# EAGLE design QFN32-TQFP32 v1.0 (EAGLE 7.2.0)
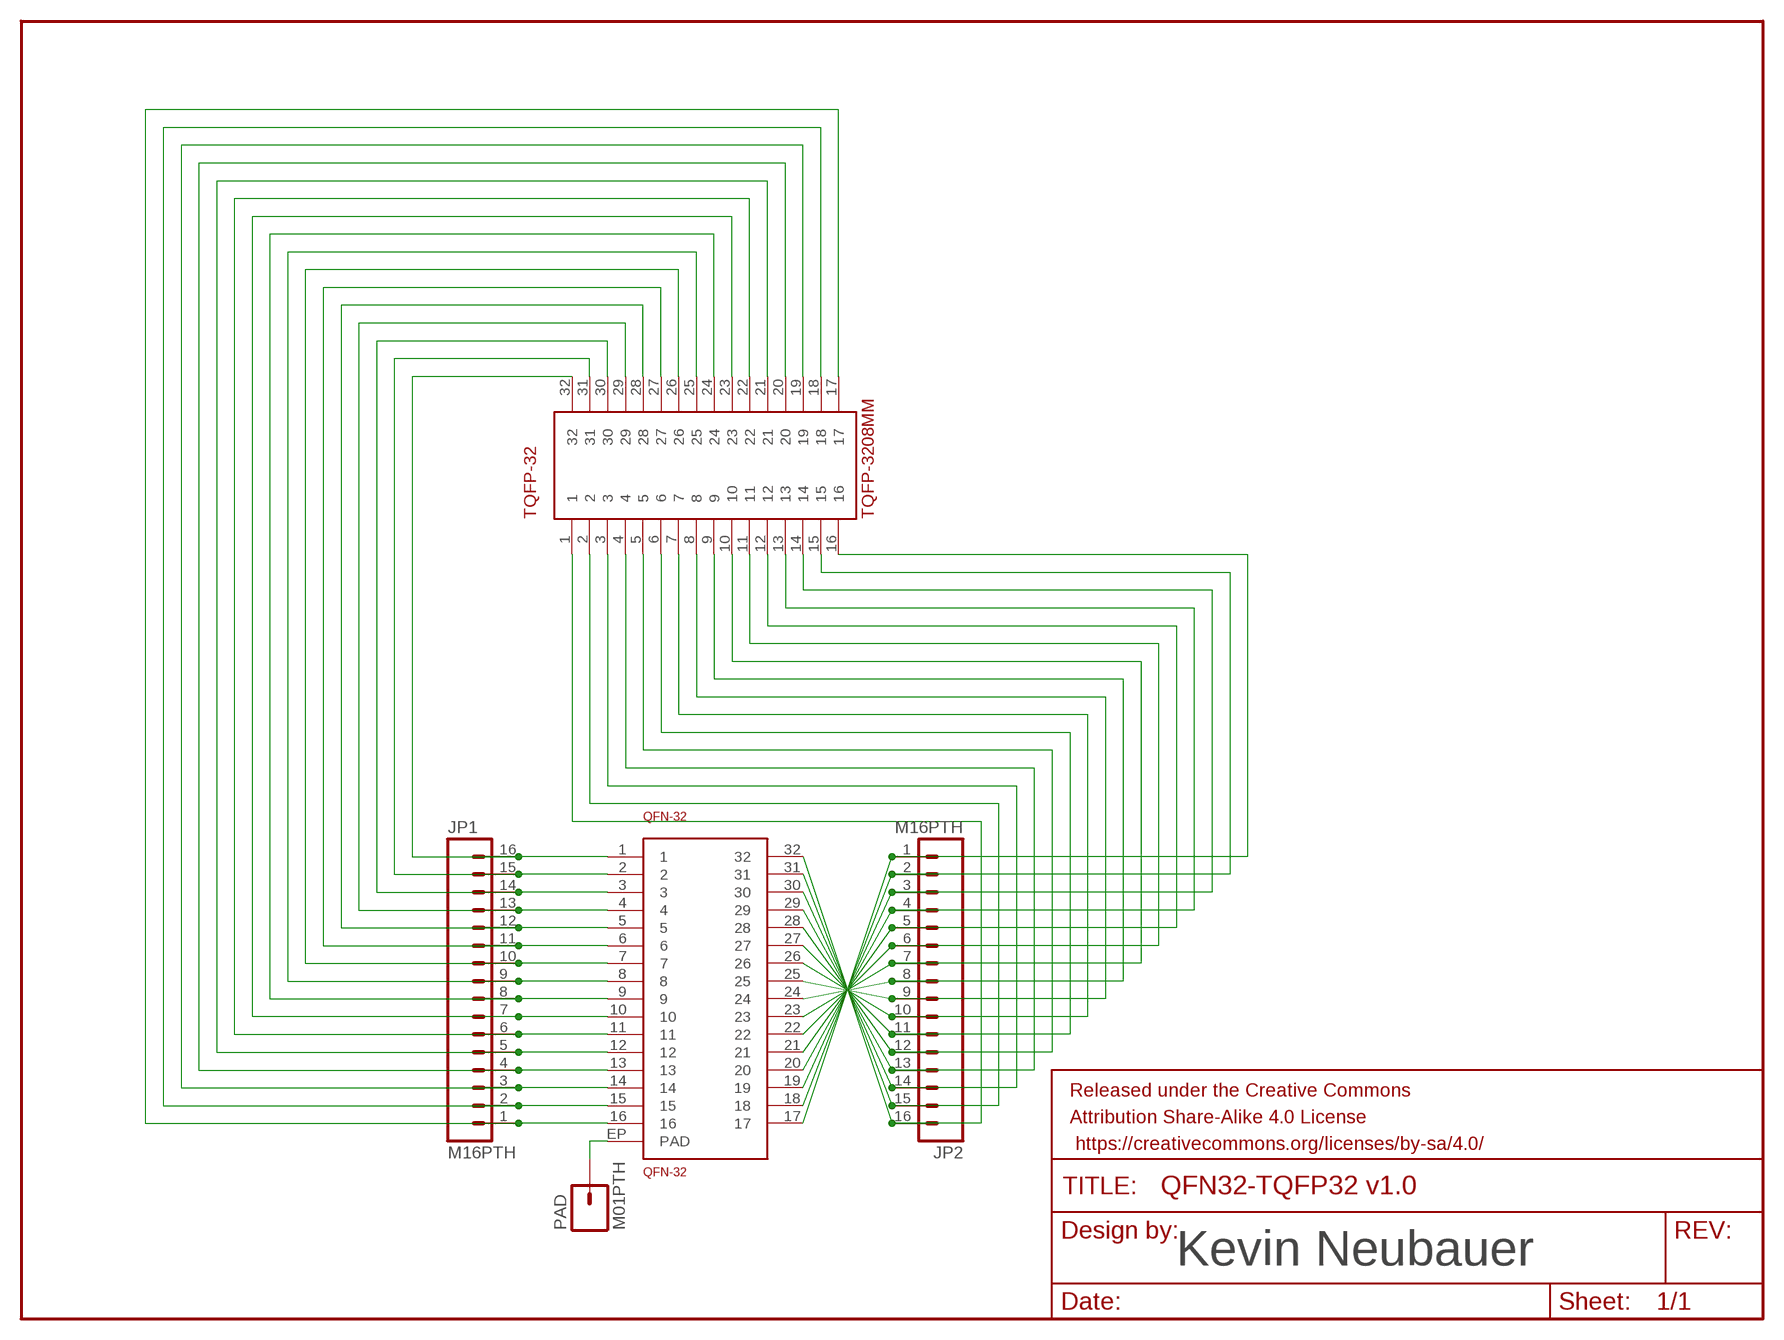
[diagram p0: schematic, sheet 1]

## Parts
FRAME1  FRAME-LETTER  [CREATIVE_COMMONS]
JP1  M16PTH  [1X16]
JP2  M16PTH  [1X16]
PAD  M01PTH  [1X01]
QFN-32  QFN-32  [QFN-32]
TQFP-32  TQFP-3208MM  [TQFP32-08]

## Nets
GND: PAD.1 QFN-32.EP(PAD)
N$1: JP2.9 QFN-32.25 TQFP-32.8
N$2: JP1.16 QFN-32.1 TQFP-32.32
N$3: JP1.15 QFN-32.2 TQFP-32.31
N$4: JP1.14 QFN-32.3 TQFP-32.30
N$5: JP1.13 QFN-32.4 TQFP-32.29
N$7: JP1.11 QFN-32.6 TQFP-32.27
N$8: JP1.10 QFN-32.7 TQFP-32.26
N$9: JP1.9 QFN-32.8 TQFP-32.25
N$10: JP1.8 QFN-32.9 TQFP-32.24
N$11: JP1.7 QFN-32.10 TQFP-32.23
N$12: JP1.6 QFN-32.11 TQFP-32.22
N$13: JP1.5 QFN-32.12 TQFP-32.21
N$14: JP1.4 QFN-32.13 TQFP-32.20
N$15: JP1.3 QFN-32.14 TQFP-32.19
N$16: JP1.2 QFN-32.15 TQFP-32.18
N$17: JP1.1 QFN-32.16 TQFP-32.17
N$20: JP2.14 QFN-32.30 TQFP-32.3
N$21: JP2.13 QFN-32.29 TQFP-32.4
N$22: JP2.12 QFN-32.28 TQFP-32.5
N$23: JP2.11 QFN-32.27 TQFP-32.6
N$24: JP2.10 QFN-32.26 TQFP-32.7
N$25: JP2.2 QFN-32.18 TQFP-32.15
N$26: JP2.8 QFN-32.24 TQFP-32.9
N$27: JP2.7 QFN-32.23 TQFP-32.10
N$29: JP2.5 QFN-32.21 TQFP-32.12
N$30: JP2.4 QFN-32.20 TQFP-32.13
N$31: JP2.3 QFN-32.19 TQFP-32.14
N$32: JP2.15 QFN-32.31 TQFP-32.2
N$33: JP2.16 QFN-32.32 TQFP-32.1
N$35: JP2.1 QFN-32.17 TQFP-32.16
N$36: JP1.12 QFN-32.5 TQFP-32.28
N$41: JP2.6 QFN-32.22 TQFP-32.11

## Notes on the sheet
- Kevin Neubauer

## Library data of the parts
FRAME1 = SparkFun-Aesthetics:FRAME-LETTER: Schematic Frame Standard 8.5x11 US Letter frame
JP1 JP2 = SparkFun-Connectors:M16: 1x16 .1" header
PAD = SparkFun-Connectors:M01: Header 1 Standard 1-pin 0.1" header. Use with straight break away headers (SKU : PRT-00116), right angle break away headers (PRT-00553), swiss pins (PRT-00743), machine pins (PRT-00117), and female headers (PRT-00115).
QFN-32 = Kevin-GenericICFootprints:QFN-32
TQFP-32 = Kevin-GenericICFootprints:TQFP-32

## Board
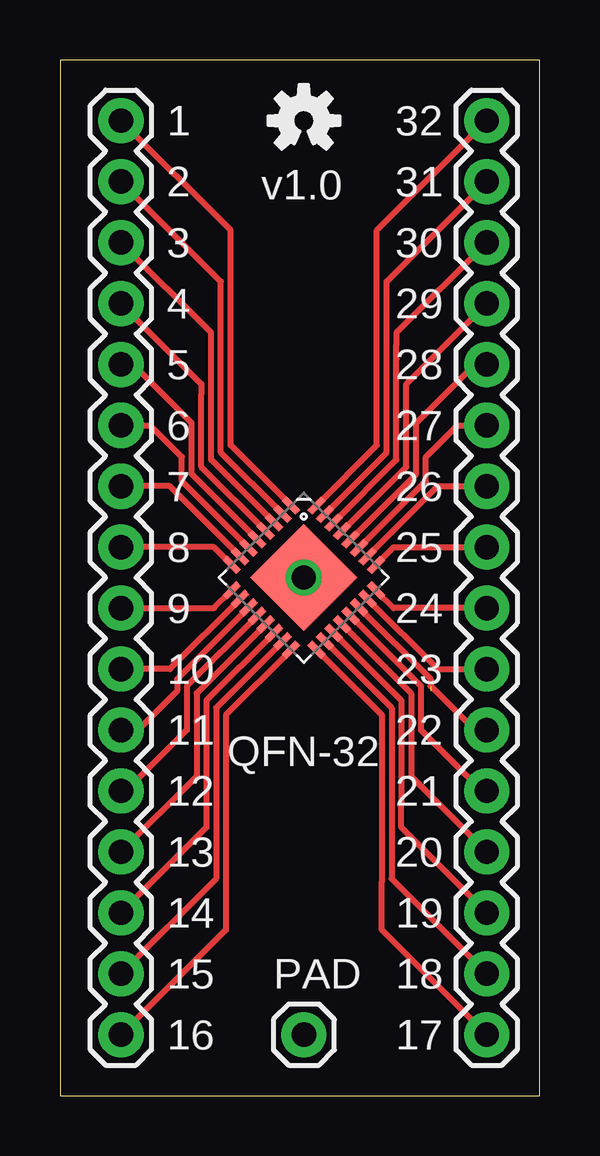
[diagram p1: board, top side]
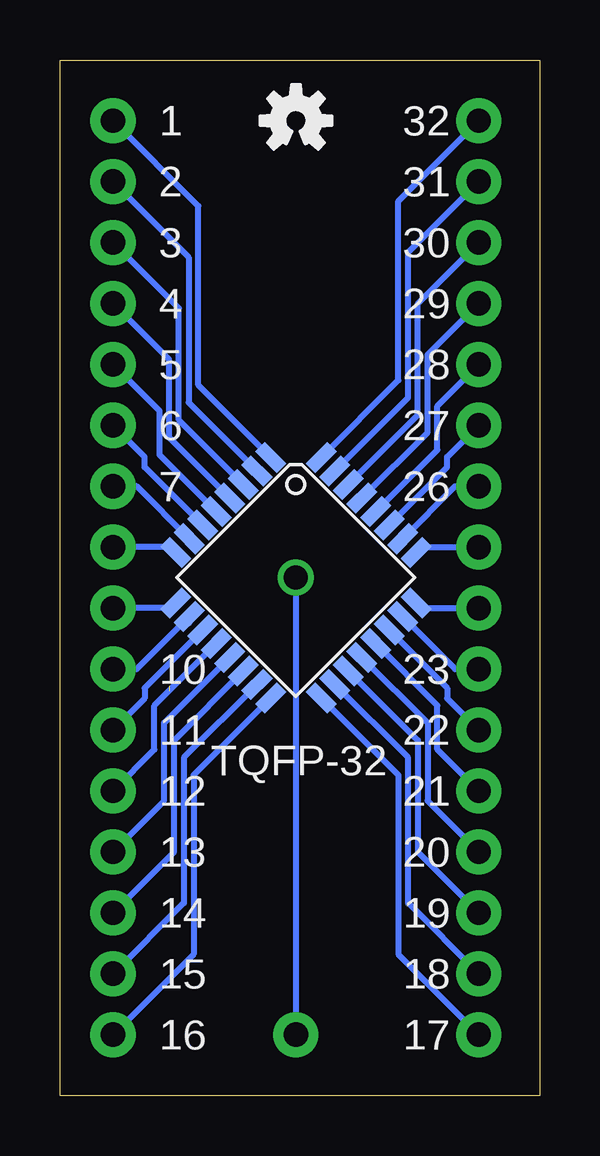
[diagram p2: board, bottom side, seen from below]

Size 19.99 x 43.17 mm. Coordinates in mm from the lower left corner, seen from the top.
Outline: 0,0 19.99,0 19.99,43.17 0,43.17 0,0
Copper layers (1*16): Top 0.0356mm / dielectric 1.5011mm / Bottom 0.0356mm
Design rules "OSH Park": minimum track width 6mil, minimum drill 13mil, track to track 6mil, track to pad 6mil, pad to pad 6mil, via to via 6mil, smd to smd 6mil, copper to edge 15mil, drill to drill 6mil, minimum pad ring 7mil, minimum via ring 7mil, stop-mask expansion 3mil, vias tented up to drill 0mil, thermal gap 10mil

### Footprints (pad centres in the part's own frame; a part is rotated, then mirrored left to right if it is on the bottom)
1X16 = drill 1.016 pad 1.88: 1 0,0; 2 2.54,0; 3 5.08,0; 4 7.62,0; 5 10.16,0; 6 12.7,0; 7 15.24,0; 8 17.78,0; 9 20.32,0; 10 22.86,0; 11 25.4,0; 12 27.94,0; 13 30.48,0; 14 33.02,0; 15 35.56,0; 16 38.1,0
1X01 = drill 1.016 pad 1.88: 1 0,0
QFN-32 = smd 0.285 x 0.8: 1 -1.75,-2.5; 2 -1.25,-2.5; 3 -0.75,-2.5; 4 -0.25,-2.5; 5 0.25,-2.5; 6 0.75,-2.5; 7 1.25,-2.5; 8 1.75,-2.5; 17 1.75,2.5; 18 1.25,2.5; 19 0.75,2.5; 20 0.25,2.5; 21 -0.25,2.5; 22 -0.75,2.5; 23 -1.25,2.5; 24 -1.75,2.5 | smd 0.8 x 0.285: 9 2.5,-1.75; 10 2.5,-1.25; 11 2.5,-0.75; 12 2.5,-0.25; 13 2.5,0.25; 14 2.5,0.75; 15 2.5,1.25; 16 2.5,1.75; 25 -2.5,1.75; 26 -2.5,1.25; 27 -2.5,0.75; 28 -2.5,0.25; 29 -2.5,-0.25; 30 -2.5,-0.75; 31 -2.5,-1.25; 32 -2.5,-1.75 | smd 3.15 x 3.15: EP 0,0
TQFP32-08 = smd 1.27 x 0.559: 1 -4.293,2.8; 2 -4.293,2; 3 -4.293,1.2; 4 -4.293,0.4; 5 -4.293,-0.4; 6 -4.293,-1.2; 7 -4.293,-2; 8 -4.293,-2.8; 17 4.293,-2.8; 18 4.293,-2; 19 4.293,-1.2; 20 4.293,-0.4; 21 4.293,0.4; 22 4.293,1.2; 23 4.293,2; 24 4.293,2.8 | smd 0.559 x 1.27: 9 -2.8,-4.293; 10 -2,-4.293; 11 -1.2,-4.293; 12 -0.4,-4.293; 13 0.4,-4.293; 14 1.2,-4.293; 15 2,-4.293; 16 2.8,-4.293; 25 2.8,4.293; 26 2,4.293; 27 1.2,4.293; 28 0.4,4.293; 29 -0.4,4.293; 30 -1.2,4.293; 31 -2,4.293; 32 -2.8,4.293

### Placement (x,y rotation side)
FRAME1  -7.37,-7.87 0 top  (outside the outline)
JP1  2.54,2.54 90 top
JP2  17.78,2.54 90 top
PAD  10.16,2.54 0 top
QFN-32  10.16,21.59 225 top
TQFP-32  10.16,21.59 315 bottom
U$1  [OSHW-LOGO-S]  10.16,40.64 0 top
U$2  [OSHW-LOGO-S]  10.16,40.64 0 bottom

### Tracks (layer width: path | path; a pad name or v marks a point on that pad's centre or on a via)
GND  (via drill 1)
  Bottom 0.254: QFN-32.EP PAD.1
  other vias: 10.16,21.59
N$1
  Top 0.254: QFN-32.25 13.91,22.86 JP2.9
  Bottom 0.254: TQFP-32.8 15.39,22.86 JP2.9
N$2
  Top 0.254: QFN-32.1 7.11,27.11 7.11,36.07 JP1.16
  Bottom 0.254: TQFP-32.32 5.89,29.82 5.89,37.29 JP1.16
N$3
  Top 0.254: QFN-32.2 6.71,26.81 6.71,33.93 JP1.15
  Bottom 0.254: TQFP-32.31 5.49,29.09 5.49,35.15 JP1.15
N$4
  Top 0.254: QFN-32.3 6.3,26.51 6.3,31.8 JP1.14
  Bottom 0.254: TQFP-32.30 5.08,28.37 5.08,33.02 JP1.14
N$5
  Top 0.254: QFN-32.4 5.89,26.21 5.89,29.26 5.89,29.67 JP1.13
  Bottom 0.254: TQFP-32.29 4.67,27.64 4.67,30.89 JP1.13
N$7
  Top 0.254: QFN-32.6 5.08,25.61 5.08,26.62 3.76,27.94 JP1.11
  Bottom 0.254: 6.07,23.78 TQFP-32.27 3.86,26.19 3.86,26.62 JP1.11
N$8
  Top 0.254: QFN-32.7 4.58,25.4 JP1.10
  Bottom 0.254: TQFP-32.26 3.52,25.4 JP1.10
N$9
  Top 0.254: QFN-32.8 6.41,22.86 JP1.9
  Bottom 0.254: TQFP-32.25 4.93,22.86 JP1.9
N$10
  Top 0.254: JP1.8 6.41,20.32 QFN-32.9
  Bottom 0.254: TQFP-32.24 4.93,20.32 JP1.8
N$11
  Top 0.254: QFN-32.10 4.58,17.78 JP1.7
  Bottom 0.254: TQFP-32.23 3.52,17.78 JP1.7
N$12
  Top 0.254: QFN-32.11 4.88,17.37 4.88,16.87 3.25,15.24 JP1.6
  Bottom 0.254: TQFP-32.22 3.86,16.99 3.86,16.56 JP1.6
N$13
  Top 0.254: QFN-32.12 5.28,17.07 5.28,15.24 2.74,12.7 JP1.5
  Bottom 0.254: TQFP-32.21 4.27,16.26 4.27,14.43 JP1.5
N$14
  Top 0.254: QFN-32.13 5.69,16.77 5.69,13.31 JP1.4
  Bottom 0.254: TQFP-32.20 4.67,15.54 4.67,12.29 JP1.4
N$15
  Top 0.254: QFN-32.14 6.1,16.46 6.1,11.18 JP1.3
  Bottom 0.254: TQFP-32.19 5.08,14.81 5.08,10.16 JP1.3
N$16
  Top 0.254: QFN-32.15 6.5,16.16 6.5,9.04 JP1.2
  Bottom 0.254: TQFP-32.18 5.49,14.09 5.49,8.03 JP1.2
N$17
  Top 0.254: QFN-32.16 6.91,15.86 6.91,6.91 JP1.1
  Bottom 0.254: TQFP-32.17 5.89,13.36 5.89,5.89 JP1.1
N$20
  Top 0.254: QFN-32.30 14.02,26.51 14.02,30.68 14.02,31.29 14.02,31.8 JP2.14
  Bottom 0.254: TQFP-32.3 15.04,28.16 15.04,32.82 JP2.14
N$21
  Top 0.254: QFN-32.29 14.43,26.21 14.43,29.67 JP2.13
  Bottom 0.254: TQFP-32.4 15.44,27.44 15.44,30.68 JP2.13
N$22
  Top 0.254: QFN-32.28 14.83,25.91 14.83,28.04 17.27,30.48 JP2.12
  Bottom 0.254: TQFP-32.5 15.85,26.71 15.85,28.55 JP2.12
N$23
  Top 0.254: QFN-32.27 15.24,25.61 15.24,26.62 16.56,27.94 JP2.11
  Bottom 0.254: TQFP-32.6 16.46,26.19 16.46,26.62 JP2.11
N$24
  Top 0.254: QFN-32.26 15.74,25.4 JP2.10
  Bottom 0.254: TQFP-32.7 16.8,25.4 JP2.10
N$25
  Top 0.254: QFN-32.18 13.82,16.16 13.82,9.04 JP2.2
  Bottom 0.254: TQFP-32.15 14.83,14.09 14.83,8.03 JP2.2
N$26
  Top 0.254: JP2.8 13.91,20.32 QFN-32.24
  Bottom 0.254: TQFP-32.9 15.39,20.32 JP2.8
N$27
  Top 0.254: QFN-32.23 15.74,17.78 JP2.7
  Bottom 0.254: 14.61,19.68 TQFP-32.10 16.8,17.78 JP2.7
N$29
  Top 0.254: QFN-32.21 15.04,17.07 15.04,15.24 17.58,12.7 JP2.5
  Bottom 0.254: TQFP-32.12 16.05,16.26 16.05,14.43 JP2.5
N$30
  Top 0.254: QFN-32.20 14.63,16.77 14.63,13.31 JP2.4
  Bottom 0.254: TQFP-32.13 15.65,15.54 15.65,12.29 JP2.4
N$31
  Top 0.254: QFN-32.19 14.22,16.46 14.22,12.39 14.22,12.19 14.22,11.18 JP2.3
  Bottom 0.254: TQFP-32.14 15.24,14.81 15.24,10.16 JP2.3
N$32
  Top 0.254: QFN-32.31 13.61,26.81 13.61,33.93 JP2.15
  Bottom 0.254: TQFP-32.2 14.63,28.89 14.63,34.95 JP2.15
N$33
  Top 0.254: QFN-32.32 13.21,27.11 13.21,36.07 JP2.16
  Bottom 0.254: TQFP-32.1 14.22,29.61 14.22,37.08 JP2.16
N$35
  Top 0.254: QFN-32.17 13.41,15.86 13.41,9.35 13.41,8.94 13.41,6.91 JP2.1
  Bottom 0.254: TQFP-32.16 14.43,13.36 14.43,5.89 JP2.1
N$36
  Top 0.254: QFN-32.5 5.49,25.91 5.49,28.04 3.05,30.48 JP1.12
  Bottom 0.254: TQFP-32.28 4.27,26.92 4.27,28.75 JP1.12
N$41  (1 unrouted)
  Top 0.254: QFN-32.22 15.44,17.37 15.44,17.07 17.27,15.24 JP2.6
  Bottom 0.254: TQFP-32.11 16.46,16.99 16.46,16.56 JP2.6

### Text on the board
tPlace: 1 | 32 | 2 | v1.0 | 31 | 3 | 30 | 4 | 29 | 5 | 28 | 6 | 27 | 7 | 26 | 8 | 25 | 9 | 24 | 10 | 23 | 11 | QFN-32 | 22 | 12 | 21 | 13 | 20 | 14 | 19 | 15 | PAD | 18 | 16 | 17
bPlace: 32 | 1 | 31 | 2 | 30 | 3 | 29 | 4 | 28 | 5 | 27 | 6 | 26 | 7 | 23 | 10 | 22 | 11 | TQFP-32 | 21 | 12 | 20 | 13 | 19 | 14 | 18 | 15 | 17 | 16
tDocu: Kevin Neubauer